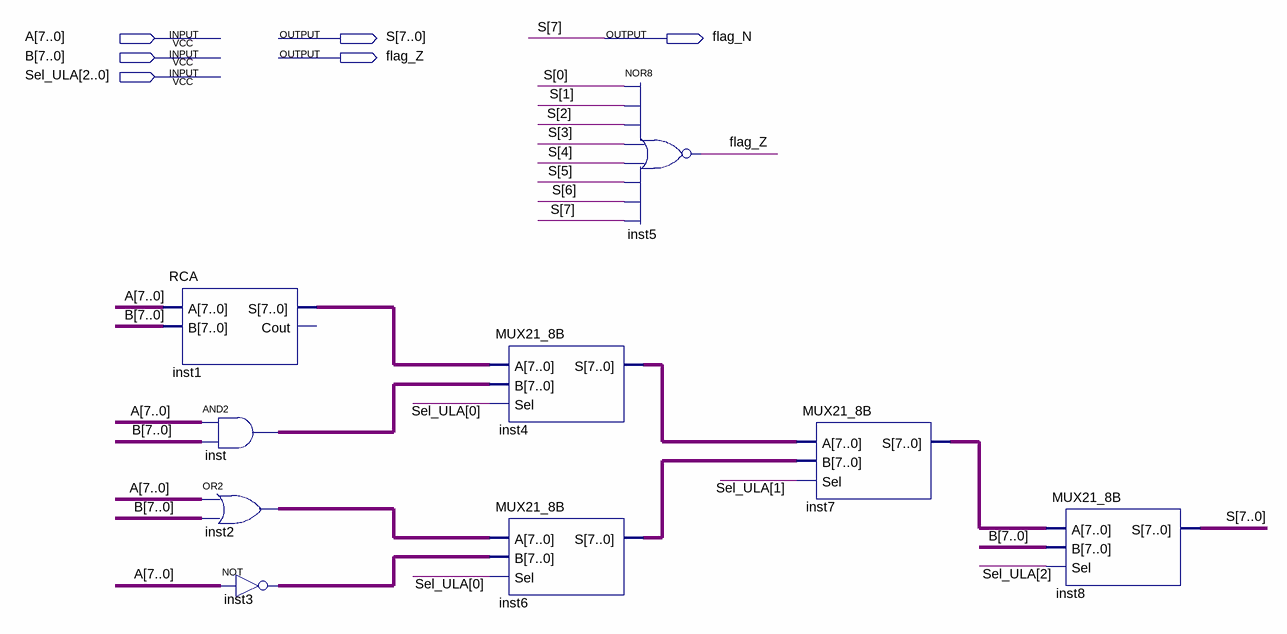
[diagram p0: schematic sheet]
// Quartus schematic ULA.bdf as structural Verilog: 9 symbols, 6 pins
module ULA (
  input  [7:0] A,
  input  [7:0] B,
  input  [2:0] Sel_ULA,
  output [7:0] S,
  output flag_N,
  output flag_Z
);

  wire [7:0] inst1_s, inst2_out, inst3_out, inst4_s, inst6_s, inst7_s, inst_out;

  RCA inst1 (.A(A), .B(B), .S(inst1_s));  // open: Cout
  assign inst_out = A & B;  // AND2 inst, 8 bits wide
  assign inst2_out = A | B;  // OR2 inst2, 8 bits wide
  assign inst3_out = ~A;  // NOT inst3, 8 bits wide
  MUX21_8B inst4 (.A(inst1_s), .B(inst_out), .Sel(Sel_ULA[0]), .S(inst4_s));
  MUX21_8B inst6 (.A(inst2_out), .B(inst3_out), .Sel(Sel_ULA[0]), .S(inst6_s));
  nor inst5 (flag_Z, S[0], S[1], S[2], S[3], S[4], S[5], S[6], flag_N);
  MUX21_8B inst7 (.A(inst4_s), .B(inst6_s), .Sel(Sel_ULA[1]), .S(inst7_s));
  MUX21_8B inst8 (.A(inst7_s), .B(B), .Sel(Sel_ULA[2]), .S({flag_N, S[6:0]}));

  assign S[7] = flag_N;
endmodule
